# Altium schematic sheet Analog Digital Converter.SchDoc: Analog Digital Converter
size 292 x 193 mm; DocumentNumber: 54; SheetNumber: 42; SheetTotal: 42
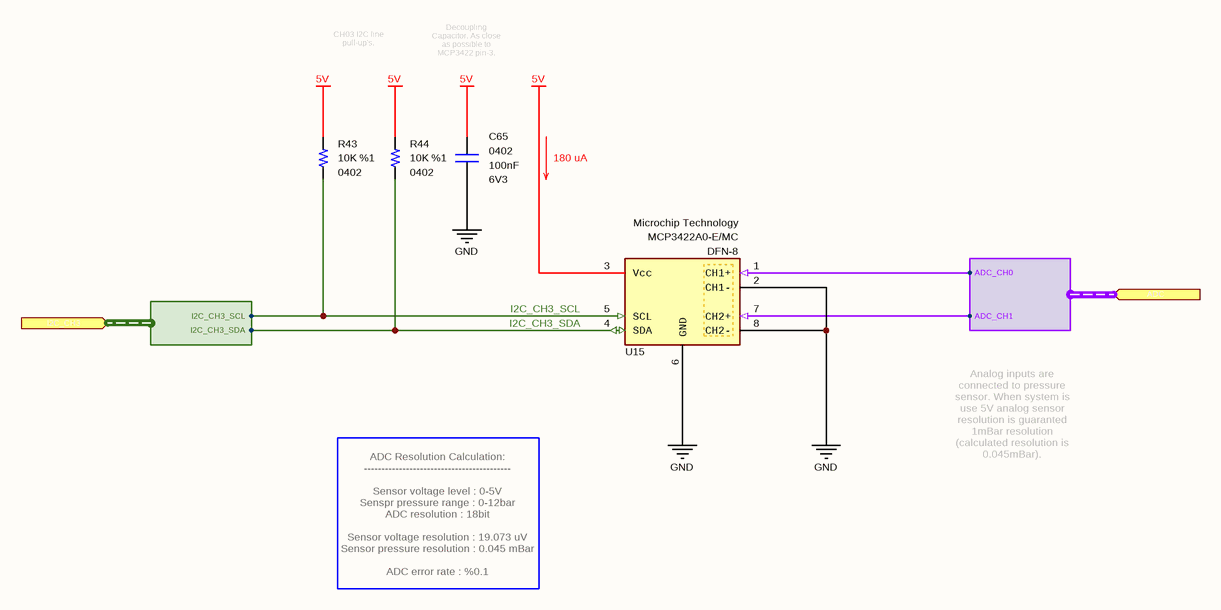
[diagram p0: Analog Digital Converter.SchDoc]

## Parts
C65  value 100nF  Case: 0402  Voltage: 6V3  [CAPACITOR_0402]  (hidden comment: Multilayer Ceramic Capacitor)
R43  value 10K  Tolerance: %1  Case: 0402  [RESISTOR_0402]  (hidden comment: Thick Film Resistor)
R44  value 10K  Tolerance: %1  Case: 0402  [RESISTOR_0402]  (hidden comment: Thick Film Resistor)
U15  Manufacturer Part Number: MCP3422A0-E/MC  Manufacturer Name: Microchip Technology  [DFN-8]  (hidden comment: Analog to Digital Converters - ADC)

## Ports
ADC (in, harness ADC), I2C_CH3 (in, harness I2C_CH3)

## Harnesses
I2C_CH3: I2C_CH3_SDA, I2C_CH3_SCL
ADC: ADC_CH0, ADC_CH1

## Nets
5V: C65.2 R43.2 R44.2 U15.3(Vcc)
GND: C65.1 U15.2(CH1-) U15.6(GND) U15.8(CH2-)
I2C_CH3_SCL: R43.1 U15.5(SCL) ; port I2C_CH3.I2C_CH3_SCL
I2C_CH3_SDA: R44.1 U15.4(SDA) ; port I2C_CH3.I2C_CH3_SDA
NetU15_1: U15.1(CH1+) ; port ADC.ADC_CH0
NetU15_7: U15.7(CH2+) ; port ADC.ADC_CH1

## Notes on the sheet
- CH03 I2C line pull-up's.
- Decoupling Capacitor. As close as possible to MCP3422 pin-3.
- 180 uA
- Analog inputs are connected to pressure sensor. When system is use 5V analog sensor resolution is guaranted 1mBar resolution (calculated resolution is 0.045mBar).
- ADC Resolution Calculation:
  ------------------------------------------
  Sensor voltage level : 0-5V
  Senspr pressure range : 0-12bar
  ADC resolution : 18bit
  Sensor voltage resolution : 19.073 uV
  Sensor pressure resolution : 0.045 mBar
  ADC error rate : %0.1
- © 2021 All rights reserved.
  This document may not, in whole or in part, be copied, photocopied, reproduced, translated or converted to any electronic or machine readable from without prior written permission of Mehmet Günce Akkoyun.
  Engineer contact : akkoyun@me.com
- Property of
- Engineer :
- Date :
- Size :
- A4
- Time :
- Project :
- Page :
- /
- Customer :
- Product ID :
- Module ID :
- Version :
- File :
- Revision :

## Library data of the parts
C65 = Capacitor - 100nF [0402-6V3]: Capacitor - 100nF [0402-6V3] (Ceramic); Manufacturer Name: AVX; Manufacturer Part Number: 04026D104KAT4A; Dielectric: X5R; Tolerance: %10; Height: 0.25mm; ComponentLink1Description: Mouser; ComponentLink1URL: https://www.mouser.com.tr/ProductDetail/AVX/04026D104KAT4A?qs=sGAEpiMZZMs0AnBnWHyRQPg4iYkCw7IMED%2F4kpqgf7w%3D; ComponentLink2Description: DataSheet; ComponentLink2URL: https://www.mouser.com.tr/datasheet/2/40/cx5r-776519.pdf; ROHS: Yes; Maximum Operating Temperature: +85; Minimum Operating Temperature: -55; Supplier 1: Avnet; Supplier Part Number 1: 04026D104KAT4A; Mouser Part Number: 581-04026D104KAT4A
R43 R44 = Resistor - 10K: Thick Film Resistors - SMD 1/16 W 10 Kohms 1%; Manufacturer Name: Vishay; Manufacturer Part Number: CRCW040210K0FKED; Height: 0.4mm; ComponentLink1Description: DataSheet; ComponentLink1URL: https://www.mouser.com.tr/datasheet/2/427/dcrcwe3-1762152.pdf; ComponentLink2Description: Mouser; ComponentLink2URL: https://www.mouser.com.tr/ProductDetail/Vishay-Dale/CRCW040210K0FKED?qs=sGAEpiMZZMu61qfTUdNhG2DpbjADlD3GcalbOv9utCY%3D; Supplier 1: Mouser; Supplier 2: Digi-Key; Supplier Part Number 1: 71-CRCW040210K0FKEDH; Supplier Part Number 2: 541-10.0KYCT-ND; Mouser Part Number: 71-CRCW0402-10K-E3
U15 = IC - MCP3422: Analog to Digital Converters - ADC 18B delta-sigma ADC dual Ch 4sps; ComponentLink1Description: DataSheet; ComponentLink1URL: http://www.ti.com/general/docs/suppproductinfo.tsp?distId=26&gotoUrl=http%3A%2F%2Fwww.ti.com%2Flit%2Fgpn%2Ftca9517a; ComponentLink2Description: Mouser; ComponentLink2URL: https://www.mouser.com.tr/ProductDetail/Texas-Instruments/TCA9517ADGKR?qs=%252BrH4t%252BeVZ2M4pVnwXR4oNA==; Minimum Operating Temperature: -40; Maximum Operating Temperature: +125; Supplier 1: Avnet; Supplier 2: Mouser; Supplier 3: Arrow; Supplier 4: Digi-Key; Supplier Part Number 1: MCP3422A0-E/MC; Supplier Part Number 2: 579-MCP3422A0-E/MC; Supplier Part Number 3: MCP3422A0-E/MC; Supplier Part Number 4: MCP3422A0-E/MC-ND; Case: DFN-8; Mouser Part Number: 579-MCP3422A0-E/MC